# Altium schematic sheet motor_control.SchDoc
size A4; DrawnBy: Lorna Lan, Dylan Vogel; Revision: v2; SheetNumber: 4; SheetTotal: 16
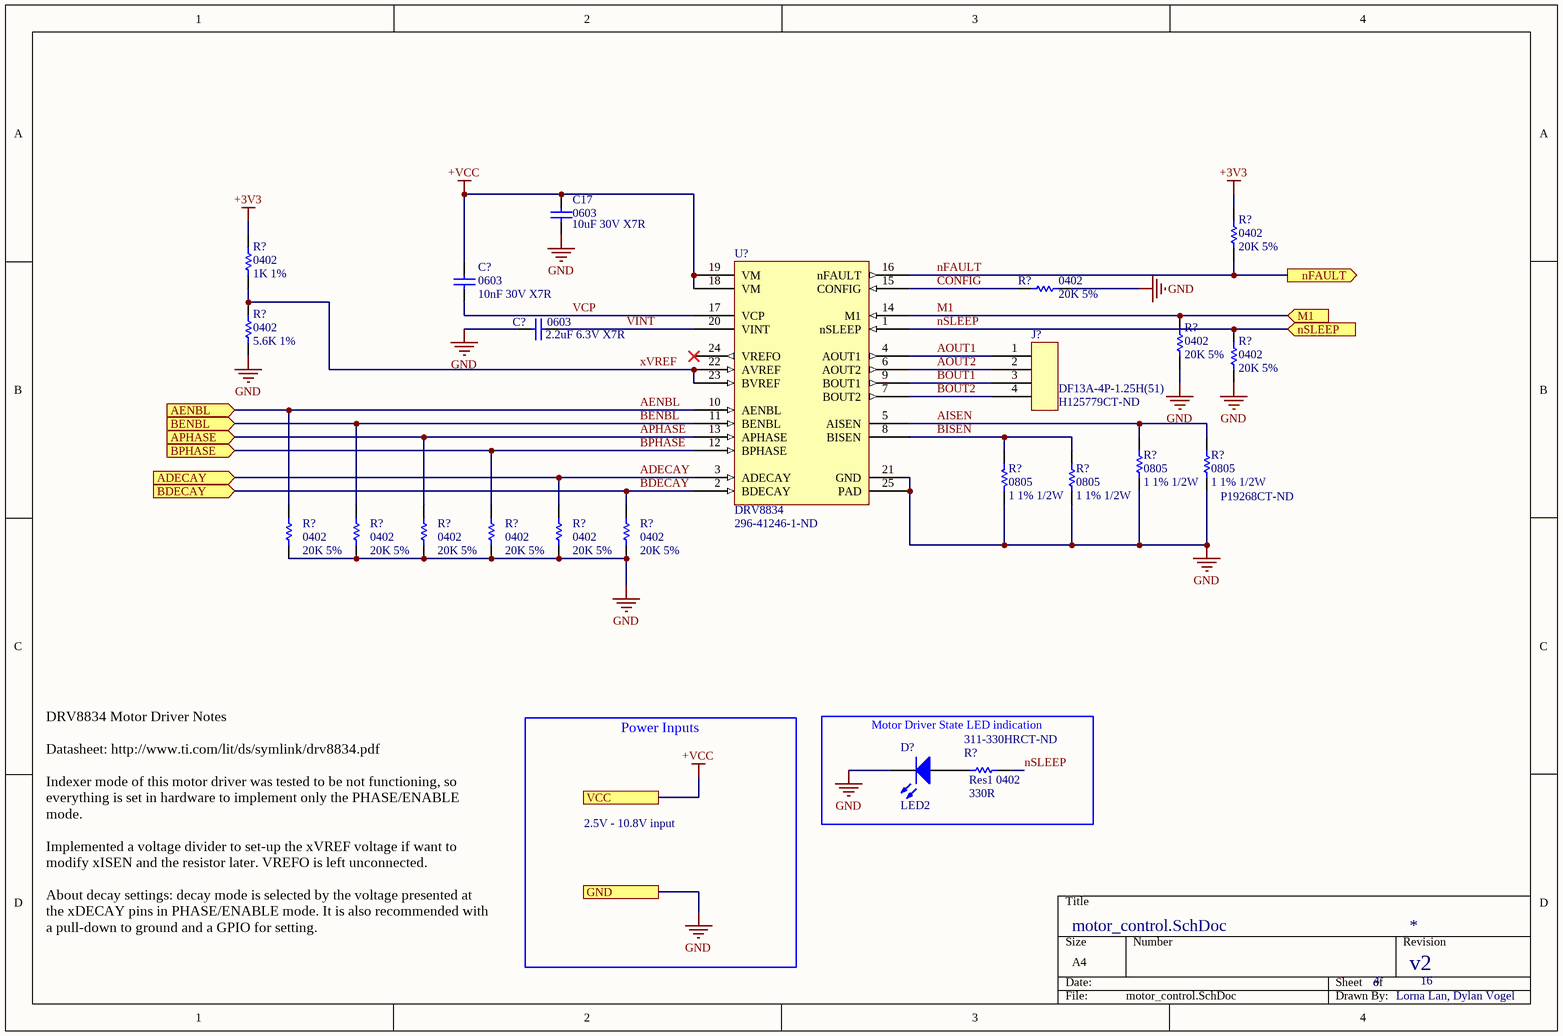
[diagram p0: motor_control.SchDoc]

## Parts
(Parts that share a designator on the sheet are numbered #1, #2 ... from top to bottom, then left to right.)
C17  0603  value 10uF 30V X7R  [1608[0603]]
C?#1  0603  value 10nF 30V X7R  [1608[0603]]
C?#2  0603  value 2.2uF 6.3V X7R  [1608[0603]]
D?  LED2  [0603-LED]
J?  DF13A-4P-1.25H(51)  Supplier Part Number 1: H125779CT-ND  [DF13A-4P-1.25H(51)]
R?#1  0402  value 20K 5%  [AXIAL-0.3]
R?#2  0402  value 1K 1%  [AXIAL-0.3]
R?#3  0402  value 20K 5%  [AXIAL-0.3]
R?#4  0402  value 5.6K 1%  [AXIAL-0.3]
R?#5  0402  value 20K 5%  [AXIAL-0.3]
R?#6  0402  value 20K 5%  [AXIAL-0.3]
R?#7  0805  value 1 1% 1/2W  [AXIAL-0.3]
R?#8  0805  value 1 1% 1/2W  Supplier Part Number 1: P19268CT-ND  [AXIAL-0.3]
R?#9  0805  value 1 1% 1/2W  [AXIAL-0.3]
R?#10  0805  value 1 1% 1/2W  [AXIAL-0.3]
R?#11  0402  value 20K 5%  [AXIAL-0.3]
R?#12  0402  value 20K 5%  [AXIAL-0.3]
R?#13  0402  value 20K 5%  [AXIAL-0.3]
R?#14  0402  value 20K 5%  [AXIAL-0.3]
R?#15  0402  value 20K 5%  [AXIAL-0.3]
R?#16  0402  value 20K 5%  [AXIAL-0.3]
R?#17  Res1 0402  value 330R  Supplier Part Number 1: 311-330HRCT-ND  [0603-RES]
U?  DRV8834  Supplier Part Number 1: 296-41246-1-ND  [SOP65P640X120-25N]

## Ports
ADECAY (in), AENBL (in), APHASE (in), BDECAY (in), BENBL (in), BPHASE (in), GND, M1 (in), nFAULT (out), nSLEEP (in), VCC

## Nets
+3V3: R?#1.2 R?#2.2
+VCC: C17.2 C?#1.2 U?.18(VM) U?.19(VM) ; port VCC
GND: C17.1 C?#2.2 D?.2(K) R?#3.1 R?#4.1 R?#5.1 R?#6.1 R?#7.2 R?#8.2 R?#9.2 R?#10.1 R?#11.1 R?#12.1 R?#13.1 R?#14.1 R?#15.1 R?#16.1 U?.21(GND) U?.25(PAD) ; port GND
ADECAY: R?#15.2 U?.3(ADECAY) ; port ADECAY
AENBL: R?#11.2 U?.10(AENBL) ; port AENBL
AISEN: R?#7.1 R?#8.1 U?.5(AISEN)
AOUT1: J?.1 U?.4(AOUT1)
AOUT2: J?.2 U?.6(AOUT2)
APHASE: R?#13.2 U?.13(APHASE) ; port APHASE
BDECAY: R?#16.2 U?.2(BDECAY) ; port BDECAY
BENBL: R?#12.2 U?.11(BENBL) ; port BENBL
BISEN: R?#9.1 R?#10.2 U?.8(BISEN)
BOUT1: J?.3 U?.9(BOUT1)
BOUT2: J?.4 U?.7(BOUT2)
BPHASE: R?#14.2 U?.12(BPHASE) ; port BPHASE
CONFIG: R?#3.2 U?.15(CONFIG)
M1: R?#5.2 U?.14(M1) ; port M1
nFAULT: R?#1.1 U?.16(nFAULT) ; port nFAULT
nSLEEP: R?#6.2 R?#17.2 U?.1(nSLEEP) ; port nSLEEP
VCP: C?#1.1 U?.17(VCP)
VINT: C?#2.1 U?.20(VINT)
xVREF: R?#2.1 R?#4.2 U?.22(AVREF) U?.23(BVREF)
NetD?_1: D?.1(A) R?#17.1

Not connected (* = marked no-connect by the designer): U? 24(VREFO)*

## Notes on the sheet
- 2.5V - 10.8V input
- Motor Driver State LED indication
- DRV8834 Motor Driver Notes
  Datasheet: http://www.ti.com/lit/ds/symlink/drv8834.pdf
  Indexer mode of this motor driver was tested to be not functioning, so everything is set in hardware to implement only the PHASE/ENABLE mode.
  Implemented a voltage divider to set-up the xVREF voltage if want to modify xISEN and the resistor later. VREFO is left unconnected.
  About decay settings: decay mode is selected by the voltage presented at the xDECAY pins in PHASE/ENABLE mode. It is also recommended with a pull-down to ground and a GPIO for setting.
- Power Inputs

## Library data of the parts
C17 C?#1 C?#2 = Cap Semi: Capacitor (Semiconductor SIM Model); Published: 8-Jun-2000; LatestRevisionDate: 29-May-2009; LatestRevisionNote: IPC-7351 Footprint Added.; PackageReference: C1206; Publisher: Altium Limited; PackageDescription: Chip Capacitor; Supplier: Digi-Key; Supplier 1: Digi-Key
  C17: Supplier Part Number: 1276-1132-1-ND
  C?#1: Supplier Part Number: 490-10475-1-ND
  C?#2: Supplier Part Number: 490-10731-1-ND
D? = LED2: Typical RED, GREEN, YELLOW, AMBER GaAs LED; Published: 8-Jun-2000; LatestRevisionDate: 17-Jul-2002; LatestRevisionNote: Re-released for DXP Platform.; PackageVersion: Feb-2002; PackageReference: 3.2X1.6X1.1; Publisher: Altium Limited; PackageDescription: SM LED; 2 Flat Leads
J? = DF13A-4P-1.25H(51): 4 pos DF13 right angle surface mount connector; Supplier 1: Digi-Key
R?#1-R?#17 = Res1: Resistor; Published: 8-Jun-2000; LatestRevisionDate: 17-Jul-2002; LatestRevisionNote: Re-released for DXP Platform.; PackageReference: AXIAL-0.3; Publisher: Altium Limited; PackageDescription: Axial Device, Thru-Hole; 2 Leads; 0.3 in Pin Spacing
  R?#7 R?#9 R?#10: Supplier 1: Digi-Key; Supplier Part Number 1: P19268CT-ND
  R?#8: Supplier 1: Digi-Key
  R?#17: ComponentLink1Description: Digikey Link; ComponentLink1URL: https://www.digikey.ca/product-detail/en/yageo/RC0603FR-07330RL/311-330HRCT-ND/730109; Supplier 1: Digi-Key
U? = DRV8834: Dual-bridge stepper or dc motor driver. 1.5A per coil with 2.5-10.8 V load supply.; Supplier 1: Digi-Key; ComponentLink1Description: Datasheet; ComponentLink1URL: http://www.ti.com/lit/ds/symlink/drv8834.pdf